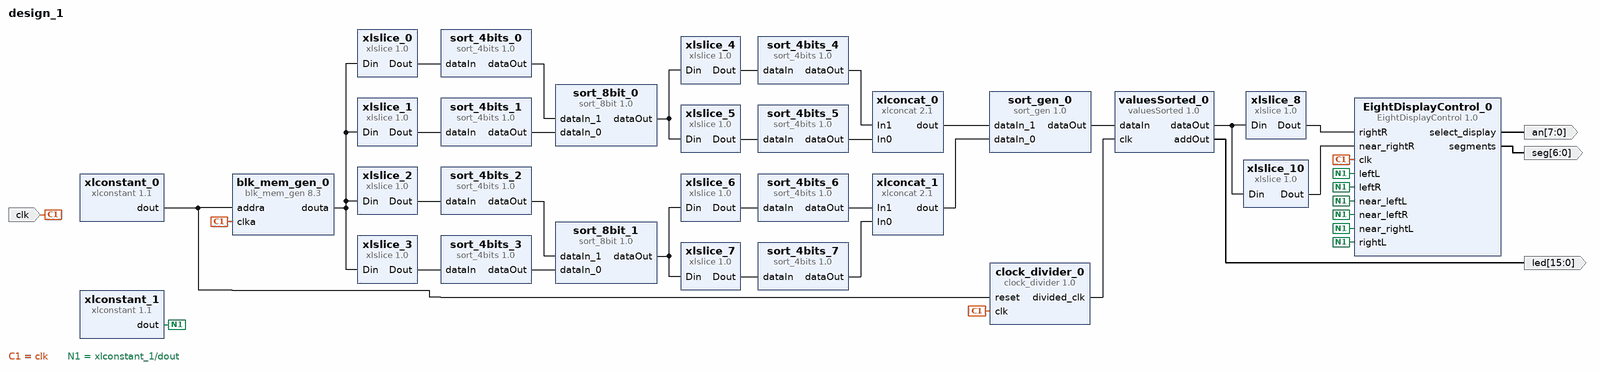
[diagram p0: block diagram of the top level]
# Vivado block design design_1, xc7a100tcsg324-1, Vivado 2016.4
create_bd_design design_1

create_bd_port -dir I -type clk clk
create_bd_port -dir O -from 7 -to 0 an
create_bd_port -dir O -from 6 -to 0 seg
create_bd_port -dir O -from 15 -to 0 led

create_bd_cell -type ip -vlnv xilinx.com:ip:blk_mem_gen:8.3 blk_mem_gen_0
set_property -dict [list \
  CONFIG.Memory_Type Single_Port_ROM \
  CONFIG.Enable_32bit_Address false \
  CONFIG.Write_Width_A 128 \
  CONFIG.Enable_A Always_Enabled \
  CONFIG.Register_PortA_Output_of_Memory_Primitives false \
  CONFIG.Load_Init_File true \
  CONFIG.Coe_File ../../../../../../../../Aula3/Aula3_estudo_ex4/coe/aula6_ex7.coe \
  CONFIG.Use_RSTA_Pin false \
  CONFIG.Port_A_Write_Rate 0 \
  CONFIG.use_bram_block Stand_Alone \
] [get_bd_cells blk_mem_gen_0]
create_bd_cell -type ip -vlnv xilinx.com:user:clock_divider:1.0 clock_divider_0
set_property -dict {CONFIG.how_fast 26} [get_bd_cells clock_divider_0]
create_bd_cell -type ip -vlnv xilinx.com:ip:xlconstant:1.1 xlconstant_0
set_property -dict {CONFIG.CONST_VAL 0} [get_bd_cells xlconstant_0]
create_bd_cell -type ip -vlnv xilinx.com:ip:xlslice:1.0 xlslice_0
set_property -dict {CONFIG.DOUT_WIDTH 32 CONFIG.DIN_TO 0 CONFIG.DIN_FROM 31 CONFIG.DIN_WIDTH 128} [get_bd_cells xlslice_0]
create_bd_cell -type ip -vlnv xilinx.com:ip:xlslice:1.0 xlslice_1
set_property -dict {CONFIG.DOUT_WIDTH 32 CONFIG.DIN_TO 32 CONFIG.DIN_FROM 63 CONFIG.DIN_WIDTH 128} [get_bd_cells xlslice_1]
create_bd_cell -type ip -vlnv xilinx.com:ip:xlslice:1.0 xlslice_2
set_property -dict {CONFIG.DOUT_WIDTH 32 CONFIG.DIN_TO 64 CONFIG.DIN_FROM 95 CONFIG.DIN_WIDTH 128} [get_bd_cells xlslice_2]
create_bd_cell -type ip -vlnv xilinx.com:ip:xlslice:1.0 xlslice_3
set_property -dict {CONFIG.DOUT_WIDTH 32 CONFIG.DIN_TO 96 CONFIG.DIN_FROM 127 CONFIG.DIN_WIDTH 128} [get_bd_cells xlslice_3]
create_bd_cell -type ip -vlnv xilinx.com:user:sort_4bits:1.0 sort_4bits_0
create_bd_cell -type ip -vlnv xilinx.com:user:sort_4bits:1.0 sort_4bits_1
create_bd_cell -type ip -vlnv xilinx.com:user:sort_4bits:1.0 sort_4bits_2
create_bd_cell -type ip -vlnv xilinx.com:user:sort_4bits:1.0 sort_4bits_3
create_bd_cell -type ip -vlnv xilinx.com:user:sort_8bit:1.0 sort_8bit_0
create_bd_cell -type ip -vlnv xilinx.com:user:sort_8bit:1.0 sort_8bit_1
create_bd_cell -type ip -vlnv xilinx.com:ip:xlslice:1.0 xlslice_4
set_property -dict {CONFIG.DOUT_WIDTH 32 CONFIG.DIN_TO 0 CONFIG.DIN_FROM 31 CONFIG.DIN_WIDTH 64} [get_bd_cells xlslice_4]
create_bd_cell -type ip -vlnv xilinx.com:ip:xlslice:1.0 xlslice_5
set_property -dict {CONFIG.DOUT_WIDTH 32 CONFIG.DIN_TO 32 CONFIG.DIN_FROM 63 CONFIG.DIN_WIDTH 64} [get_bd_cells xlslice_5]
create_bd_cell -type ip -vlnv xilinx.com:ip:xlslice:1.0 xlslice_6
set_property -dict {CONFIG.DOUT_WIDTH 32 CONFIG.DIN_TO 0 CONFIG.DIN_FROM 31 CONFIG.DIN_WIDTH 64} [get_bd_cells xlslice_6]
create_bd_cell -type ip -vlnv xilinx.com:ip:xlslice:1.0 xlslice_7
set_property -dict {CONFIG.DOUT_WIDTH 32 CONFIG.DIN_TO 32 CONFIG.DIN_FROM 63 CONFIG.DIN_WIDTH 64} [get_bd_cells xlslice_7]
create_bd_cell -type ip -vlnv xilinx.com:user:sort_4bits:1.0 sort_4bits_4
create_bd_cell -type ip -vlnv xilinx.com:user:sort_4bits:1.0 sort_4bits_5
create_bd_cell -type ip -vlnv xilinx.com:user:sort_4bits:1.0 sort_4bits_6
create_bd_cell -type ip -vlnv xilinx.com:user:sort_4bits:1.0 sort_4bits_7
create_bd_cell -type ip -vlnv xilinx.com:ip:xlconcat:2.1 xlconcat_0
set_property -dict {CONFIG.IN0_WIDTH 32 CONFIG.IN1_WIDTH 32} [get_bd_cells xlconcat_0]
create_bd_cell -type ip -vlnv xilinx.com:ip:xlconcat:2.1 xlconcat_1
set_property -dict {CONFIG.IN0_WIDTH 32 CONFIG.IN1_WIDTH 32} [get_bd_cells xlconcat_1]
create_bd_cell -type ip -vlnv xilinx.com:user:sort_gen:1.0 sort_gen_0
create_bd_cell -type ip -vlnv xilinx.com:user:valuesSorted:1.0 valuesSorted_0
create_bd_cell -type ip -vlnv xilinx.com:ip:xlslice:1.0 xlslice_8
set_property -dict {CONFIG.DOUT_WIDTH 4 CONFIG.DIN_TO 0 CONFIG.DIN_FROM 3 CONFIG.DIN_WIDTH 8} [get_bd_cells xlslice_8]
create_bd_cell -type ip -vlnv xilinx.com:ip:xlslice:1.0 xlslice_10
set_property -dict {CONFIG.DOUT_WIDTH 4 CONFIG.DIN_TO 4 CONFIG.DIN_FROM 7 CONFIG.DIN_WIDTH 8} [get_bd_cells xlslice_10]
create_bd_cell -type ip -vlnv xilinx.com:user:EightDisplayControl:1.0 EightDisplayControl_0
create_bd_cell -type ip -vlnv xilinx.com:ip:xlconstant:1.1 xlconstant_1
set_property -dict {CONFIG.CONST_WIDTH 4 CONFIG.CONST_VAL 0} [get_bd_cells xlconstant_1]

# ---- connections ----

connect_bd_net [get_bd_pins xlconstant_0/dout] [get_bd_pins clock_divider_0/reset] [get_bd_pins blk_mem_gen_0/addra]
connect_bd_net [get_bd_ports clk] [get_bd_pins clock_divider_0/clk] [get_bd_pins blk_mem_gen_0/clka] [get_bd_pins EightDisplayControl_0/clk]
connect_bd_net [get_bd_pins blk_mem_gen_0/douta] \
  [get_bd_pins xlslice_0/Din] [get_bd_pins xlslice_1/Din] [get_bd_pins xlslice_2/Din] [get_bd_pins xlslice_3/Din]
connect_bd_net [get_bd_pins xlslice_3/Dout] [get_bd_pins sort_4bits_3/dataIn]
connect_bd_net [get_bd_pins xlslice_2/Dout] [get_bd_pins sort_4bits_2/dataIn]
connect_bd_net [get_bd_pins xlslice_1/Dout] [get_bd_pins sort_4bits_1/dataIn]
connect_bd_net [get_bd_pins xlslice_0/Dout] [get_bd_pins sort_4bits_0/dataIn]
connect_bd_net [get_bd_pins sort_4bits_0/dataOut] [get_bd_pins sort_8bit_0/dataIn_1]
connect_bd_net [get_bd_pins sort_4bits_1/dataOut] [get_bd_pins sort_8bit_0/dataIn_0]
connect_bd_net [get_bd_pins sort_4bits_2/dataOut] [get_bd_pins sort_8bit_1/dataIn_1]
connect_bd_net [get_bd_pins sort_4bits_3/dataOut] [get_bd_pins sort_8bit_1/dataIn_0]
connect_bd_net [get_bd_pins sort_8bit_1/dataOut] [get_bd_pins xlslice_7/Din] [get_bd_pins xlslice_6/Din]
connect_bd_net [get_bd_pins sort_8bit_0/dataOut] [get_bd_pins xlslice_5/Din] [get_bd_pins xlslice_4/Din]
connect_bd_net [get_bd_pins xlslice_4/Dout] [get_bd_pins sort_4bits_4/dataIn]
connect_bd_net [get_bd_pins xlslice_5/Dout] [get_bd_pins sort_4bits_5/dataIn]
connect_bd_net [get_bd_pins xlslice_6/Dout] [get_bd_pins sort_4bits_6/dataIn]
connect_bd_net [get_bd_pins xlslice_7/Dout] [get_bd_pins sort_4bits_7/dataIn]
connect_bd_net [get_bd_pins sort_4bits_4/dataOut] [get_bd_pins xlconcat_0/In1]
connect_bd_net [get_bd_pins sort_4bits_5/dataOut] [get_bd_pins xlconcat_0/In0]
connect_bd_net [get_bd_pins sort_4bits_6/dataOut] [get_bd_pins xlconcat_1/In1]
connect_bd_net [get_bd_pins sort_4bits_7/dataOut] [get_bd_pins xlconcat_1/In0]
connect_bd_net [get_bd_pins xlconcat_0/dout] [get_bd_pins sort_gen_0/dataIn_1]
connect_bd_net [get_bd_pins xlconcat_1/dout] [get_bd_pins sort_gen_0/dataIn_0]
connect_bd_net [get_bd_pins sort_gen_0/dataOut] [get_bd_pins valuesSorted_0/dataIn]
connect_bd_net [get_bd_pins valuesSorted_0/dataOut] [get_bd_pins xlslice_8/Din] [get_bd_pins xlslice_10/Din]
connect_bd_net [get_bd_pins xlslice_8/Dout] [get_bd_pins EightDisplayControl_0/rightR]
connect_bd_net [get_bd_pins xlslice_10/Dout] [get_bd_pins EightDisplayControl_0/near_rightR]
connect_bd_net [get_bd_pins EightDisplayControl_0/select_display] [get_bd_ports an]
connect_bd_net [get_bd_pins EightDisplayControl_0/segments] [get_bd_ports seg]
connect_bd_net [get_bd_pins xlconstant_1/dout] \
  [get_bd_pins EightDisplayControl_0/leftR] [get_bd_pins EightDisplayControl_0/near_leftR] \
  [get_bd_pins EightDisplayControl_0/rightL] [get_bd_pins EightDisplayControl_0/near_rightL] \
  [get_bd_pins EightDisplayControl_0/near_leftL] [get_bd_pins EightDisplayControl_0/leftL]
connect_bd_net [get_bd_pins clock_divider_0/divided_clk] [get_bd_pins valuesSorted_0/clk]
connect_bd_net [get_bd_pins valuesSorted_0/addOut] [get_bd_ports led]

validate_bd_design
save_bd_design
